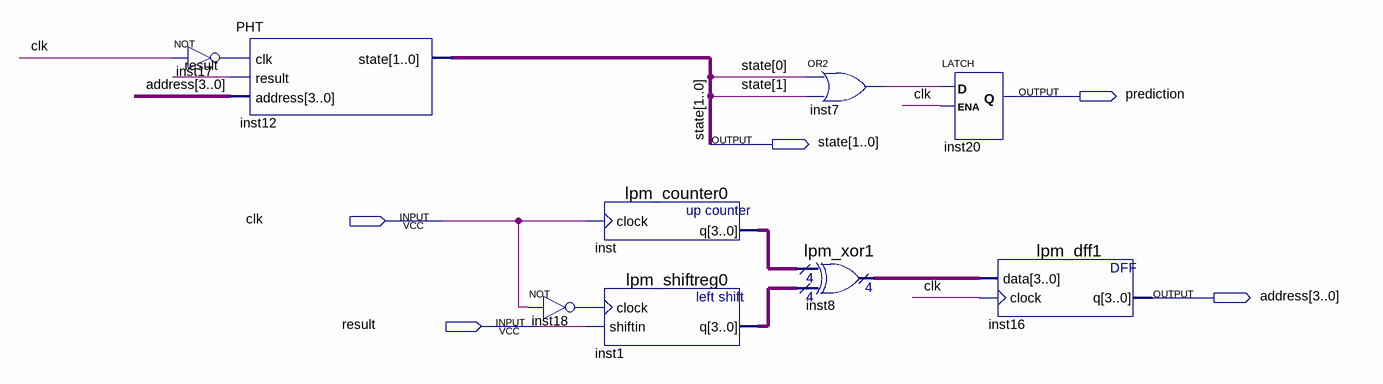
[diagram p0: schematic sheet]
// Quartus schematic Main.bdf as structural Verilog: 9 symbols, 5 pins
module Main (
  input  clk,
  input  result,
  output prediction,
  output [1:0] state,
  output [3:0] address
);

  wire inst7_out, inst17_out, inst18_out;
  wire [3:0] inst1_q, inst8_result, inst_q;

  not inst17 (inst17_out, clk);
  PHT inst12 (.clk(inst17_out), .result(result), .address(address), .state(state));
  not inst18 (inst18_out, clk);
  lpm_counter0 inst (.clock(clk), .q(inst_q));
  lpm_shiftreg0 inst1 (.clock(inst18_out), .shiftin(result), .q(inst1_q));
  or inst7 (inst7_out, state[0], state[1]);
  lpm_xor1 inst8 (.data0x(inst_q), .data1x(inst1_q), .result(inst8_result));
  LATCH inst20 (.D(inst7_out), .ENA(clk), .Q(prediction));
  lpm_dff1 inst16 (.data(inst8_result), .clock(clk), .q(address));
endmodule
